# Altium schematic sheet SENSADO.SchDoc
size A4
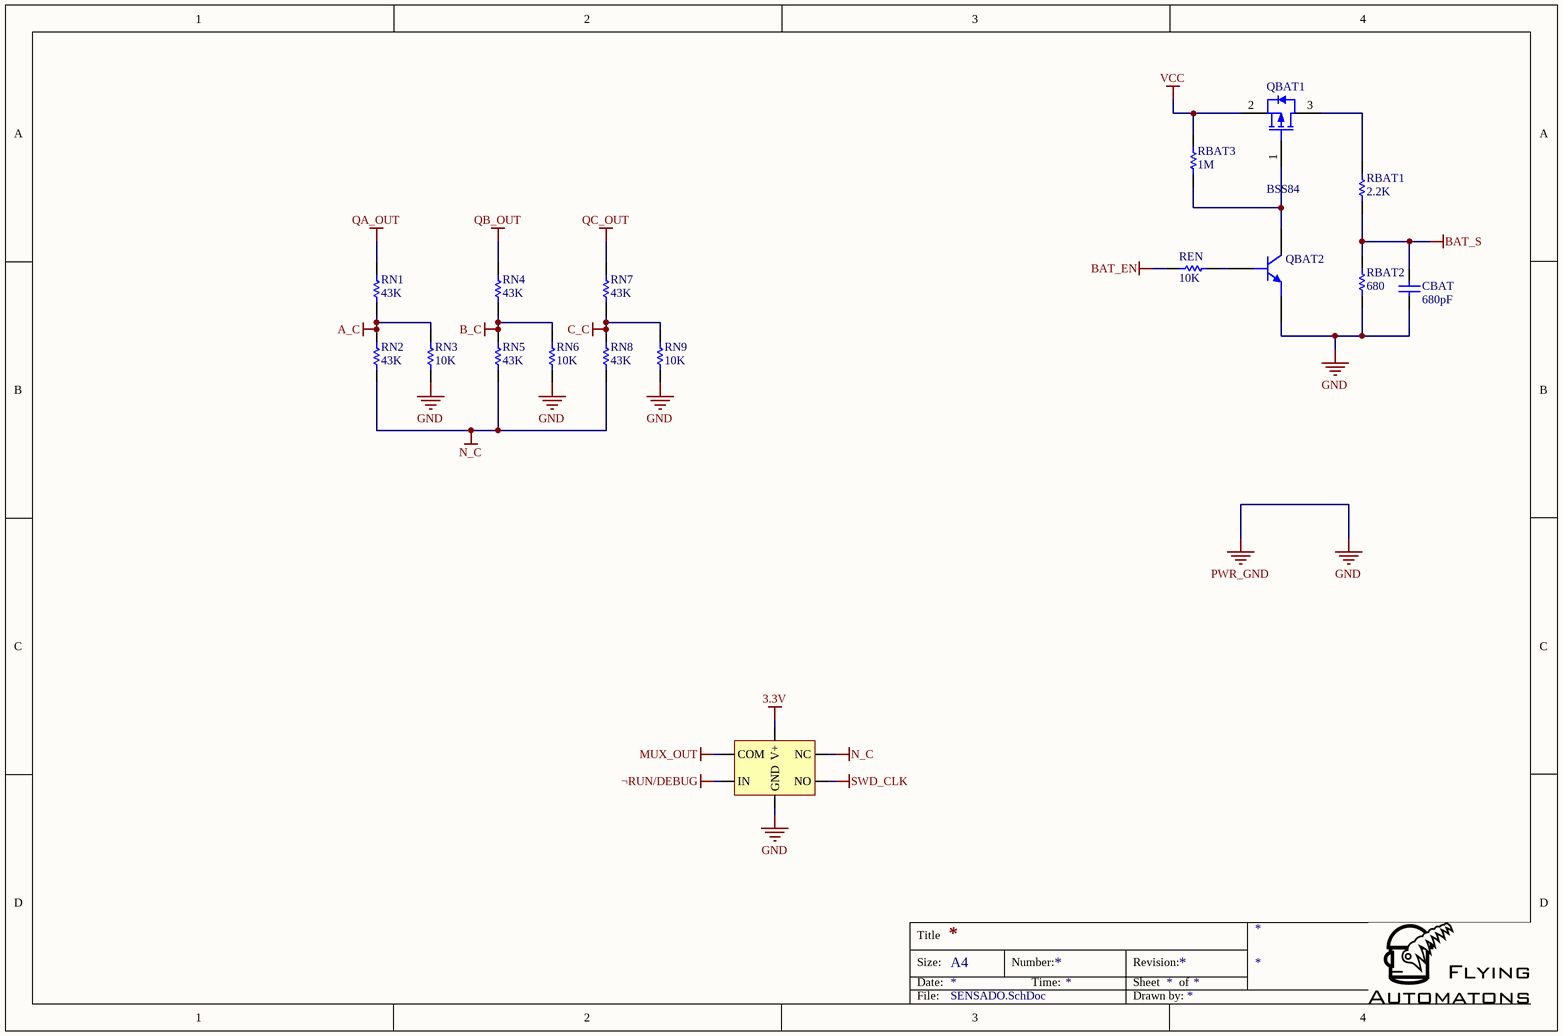
[diagram p0: SENSADO.SchDoc]

## Parts
CBAT  680pF  [CAPC1608L]
mux  TS5A3159A  [JEDEC_MO-178AB]  (value not drawn)
QBAT1  value BSS84  [SOT23-3L]
QBAT2  BJT-NPN-BEC  [SOT23-3L]  (value not drawn)
RBAT1  2.2K  [RESC1608L]
RBAT2  680  [RESC1608L]
RBAT3  1M  [RESC1608L]
REN  10K  [RESC1608L]
RN1  43K  [RESC1608L]
RN2  43K  [RESC1608L]
RN3  10K  [RESC1608L]
RN4  43K  [RESC1608L]
RN5  43K  [RESC1608L]
RN6  10K  [RESC1608L]
RN7  43K  [RESC1608L]
RN8  43K  [RESC1608L]
RN9  10K  [RESC1608L]

## Nets
3.3V: mux.5(V+)
A_C: RN1.2 RN2.1 RN3.1
B_C: RN4.2 RN5.1 RN6.1
BAT_EN: REN.2
BAT_S: CBAT.1 RBAT1.2 RBAT2.1
C_C: RN7.2 RN8.1 RN9.1
GND: CBAT.2 mux.2(GND) QBAT2.2(E) RBAT2.2 RN3.2 RN6.2 RN9.2  [also labelled PWR_GND]
MUX_OUT: mux.4(COM)
N_C: mux.3(NC) RN2.2 RN5.2 RN8.2
QA_OUT: RN1.1
QB_OUT: RN4.1
QC_OUT: RN7.1
SWD_CLK: mux.1(NO)
VCC: QBAT1.2(S) RBAT3.1
¬RUN/DEBUG: mux.6(IN)
NetQBAT1_1: QBAT1.1(G) QBAT2.3(C) RBAT3.2
NetQBAT1_3: QBAT1.3(D) RBAT1.1
NetQBAT2_1: QBAT2.1(B) REN.1

## Notes on the sheet
- Title
- Size:
- Date:
- A4
- Number:
- Time:
- Revision:
- Sheet
- of
- File:
- Drawn by:

## Library data of the parts
CBAT = CAP_680p_0603_50V_NP0_5%: CAP CER 680PF 50V 5% NP0 0603; Manufacturer: Samsung Electro-Mechanics America, Inc; Manufacturer Part Number: CL10C681JB8NFNC; Name: CAP_680p_0603_50V_NP0_5%; Value: 680pF; Supplier 1: Digi-Key; Supplier Part Number 1: 1276-2329-1-ND
mux = x-TI_TS5A3159A: IC SWITCH SPDT SOT23-6; Manufacturer: "Texas Instruments"; Manufacturer Part Number: TS5A3159ADBVR; Name: x-TI_TS5A3159A; Supplier 1: Digi-Key; Supplier Part Number 1: 296-19265-1-ND
QBAT1 = BSS84: MOSFET P-CH 50V 130MA SOT-23; Manufacturer: Fairchild Semiconductor; Name: BSS84; Manufacturer Part Number: BSS84; Supplier 1: Digi-Key; Supplier Part Number 1: BSS84CT-ND
QBAT2 = MMBT3904: TRANSISTOR NPN 40V 0.2A SOT23; Manufacturer: NXP Semiconductors; Name: MMBT3904; Value: MMBT3904; Manufacturer Part Number: MMBT3904; Supplier 1: Digi-Key; Supplier Part Number 1: 568-4510-1-ND
RBAT1 = RES_2K2_0603_0W1_1%: RES 2.2K OHM 1/10W 1% 0603 SMD; Manufacturer: Rohm Semiconductor; Manufacturer Part Number: MCR03ERTF2201; Name: RES_2K2_0603_0W1_1%; Value: 2.2K; Supplier 1: Digi-Key; Supplier Part Number 1: RHM2.20KCFCT-ND
RBAT2 = RES_680_0603_0W1_1%: RES 680 OHM 1/10W 1% 0603 SMD; Manufacturer: Rohm Semiconductor; Manufacturer Part Number: MCR03ERTF6800; Name: RES_680_0603_0W1_1%; Value: 680; Supplier 1: Digi-Key; Supplier Part Number 1: RHM680CFCT-ND
RBAT3 = RES_1M_0603_0W1_1%: RES 1.00M OHM 1/10W 1% 0603 SMD; Manufacturer: Yageo; Manufacturer Part Number: RC0603FR-071ML; Name: RES_1M_0603_0W1_1%; Value: 1M; Supplier 1: Digi-Key; Supplier Part Number 1: 311-1.00MHRCT-ND
REN RN1-RN9 = RES_10K_0603_0W1_1%: RES 10K OHM 1/10W 5% 0603; Manufacturer Part Number: RC1608J103CS; Name: RES_10K_0603_0W1_1%; Value: 10K; Supplier 1: Digi-Key; Supplier Part Number 1: 1276-5086-1-ND